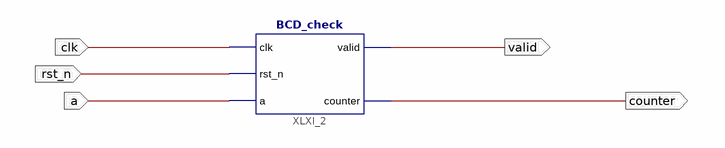
[diagram p0: schematic sheet 1]
// Xilinx ISE schematic BCD_check_simple.sch (spartan3e) as structural Verilog: 1 symbols, 5 ports
module BCD_check_simple (
  input  clk,
  input  rst_n,
  input  a,
  output counter,
  output valid
);

  BCD_check XLXI_2 (.clk(clk), .rst_n(rst_n), .a(a), .valid(valid), .counter(counter));
endmodule
